# EAGLE schematic rev_a (EAGLE 6.3)
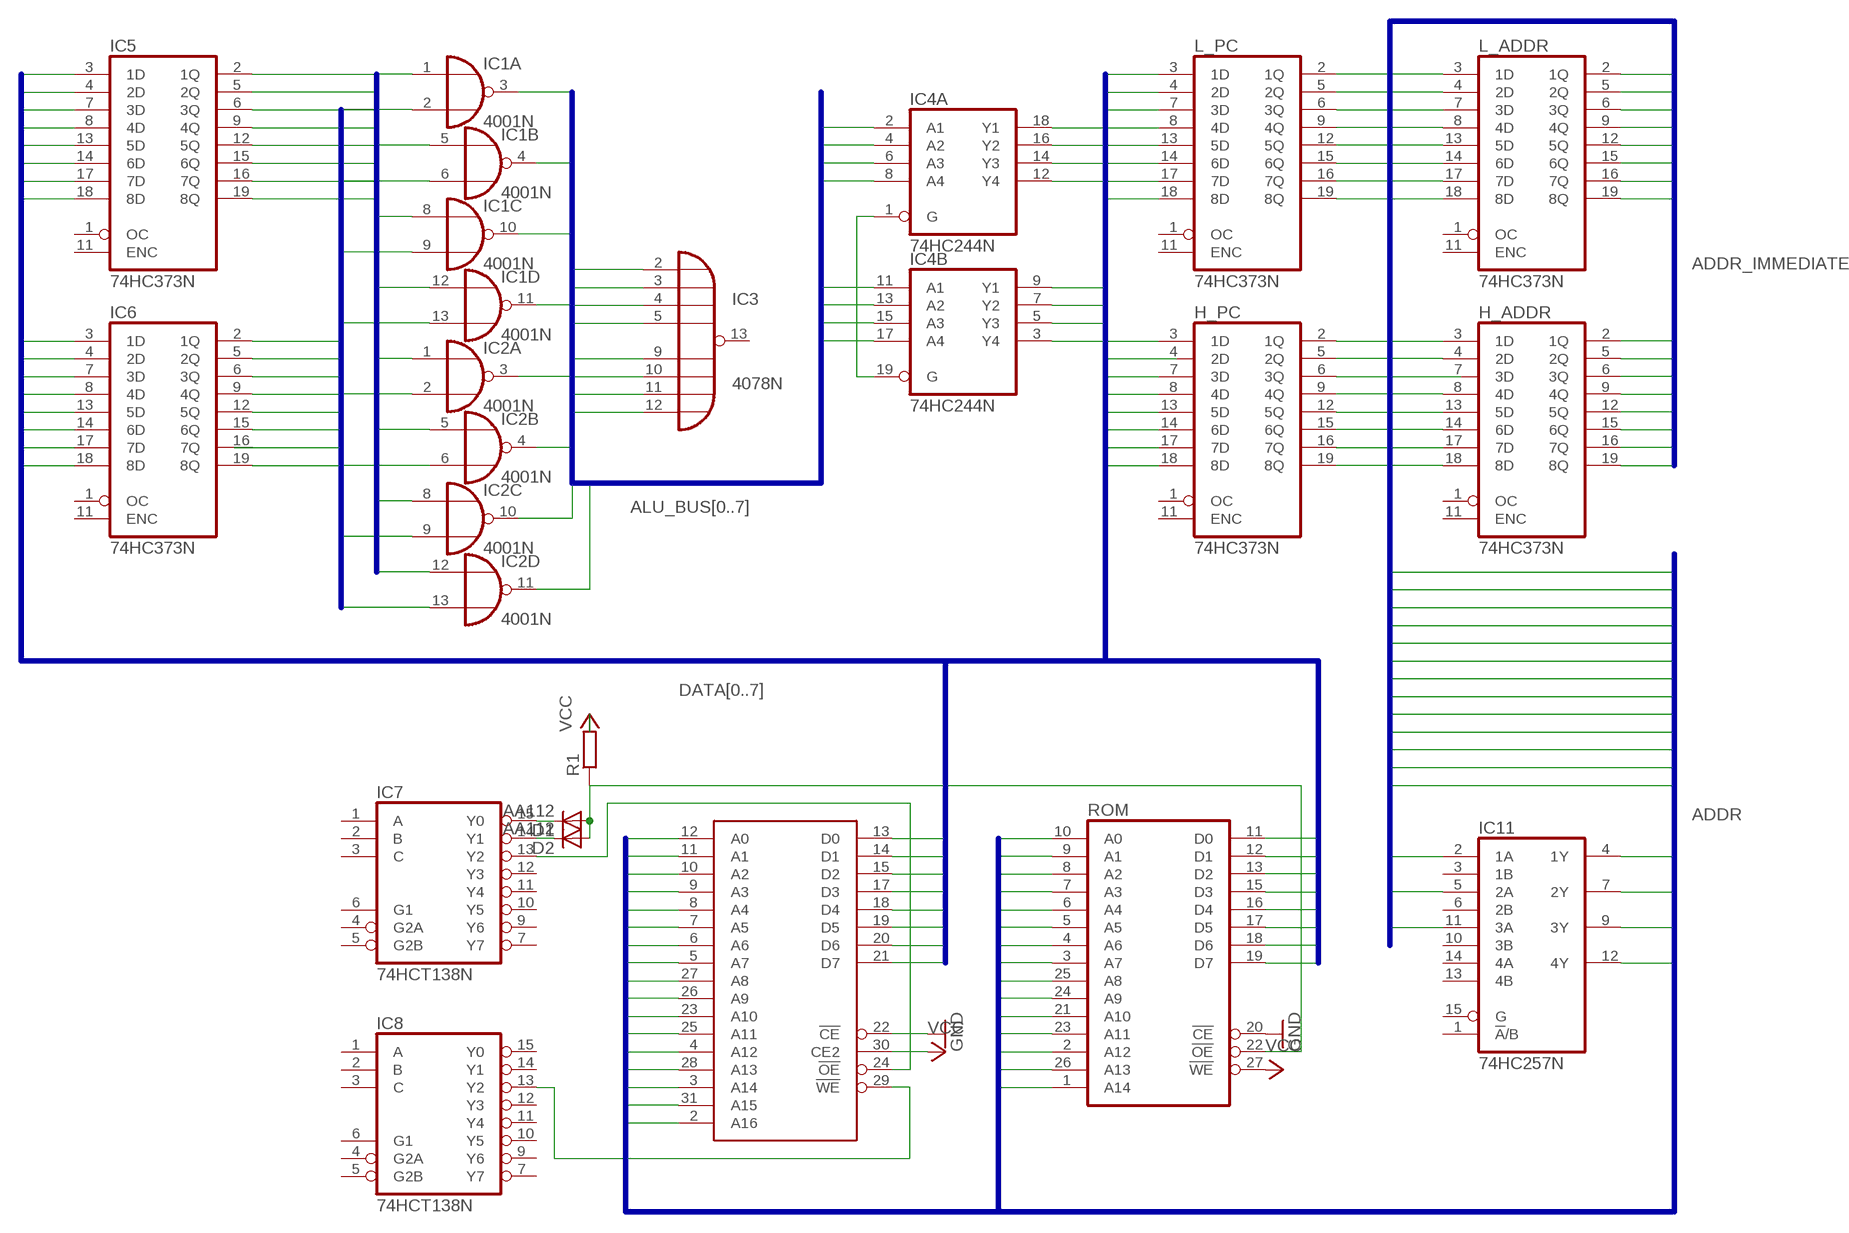
[diagram p0: schematic, sheet 1]

## Parts
D1  AA112  [DO07]
D2  AA112  [DO07]
H_ADDR  74HC373N  [DIL20]
H_PC  74HC373N  [DIL20]
IC1  4001N  [DIL14]
IC2  4001N  [DIL14]
IC3  4078N  [DIL14]
IC4  74HC244N  [DIL20]
IC5  74HC373N  [DIL20]
IC6  74HC373N  [DIL20]
IC7  74HCT138N  [DIL16]
IC8  74HCT138N  [DIL16]
IC11  74HC257N  [DIL16]
L_ADDR  74HC373N  [DIL20]
L_PC  74HC373N  [DIL20]
R1  R-EU_0207/7  [0207/7]
RAM  AS6C1008DIL32  [DIL32]
ROM  28256  [DIL28]

## Nets
A0: IC1.1(A:I0) IC5.2(1Q)
A1: IC1.5(B:I0) IC5.5(2Q)
A2: IC1.8(C:I0) IC5.6(3Q)
A3: IC1.12(D:I0) IC5.9(4Q)
A4: IC2.1(A:I0) IC5.12(5Q)
A5: IC2.5(B:I0) IC5.15(6Q)
A6: IC2.8(C:I0) IC5.16(7Q)
A7: IC2.12(D:I0) IC5.19(8Q)
ALU_BUS0: IC1.3(A:O) IC3.2(I0) IC4.2(A:A1)
ALU_BUS1: IC1.4(B:O) IC3.3(I1) IC4.4(A:A2)
ALU_BUS2: IC1.10(C:O) IC3.4(I2) IC4.6(A:A3)
ALU_BUS3: IC1.11(D:O) IC3.5(I3) IC4.8(A:A4)
ALU_BUS4: IC2.3(A:O) IC3.9(I4) IC4.11(B:A1)
ALU_BUS5: IC2.4(B:O) IC3.10(I5) IC4.13(B:A2)
ALU_BUS6: IC2.10(C:O) IC3.11(I6) IC4.15(B:A3)
ALU_BUS7: IC2.11(D:O) IC3.12(I7) IC4.17(B:A4)
B0: IC1.2(A:I1) IC6.2(1Q)
B1: IC1.6(B:I1) IC6.5(2Q)
B2: IC1.9(C:I1) IC6.6(3Q)
B3: IC1.13(D:I1) IC6.9(4Q)
B4: IC2.2(A:I1) IC6.12(5Q)
B5: IC2.6(B:I1) IC6.15(6Q)
B6: IC2.9(C:I1)
B7: IC2.13(D:I1) IC6.19(8Q)
DATA0: IC5.3(1D) IC6.3(1D)
DATA1: IC5.4(2D) IC6.4(2D)
DATA2: IC5.7(3D) IC6.7(3D)
DATA3: IC5.8(4D) IC6.8(4D)
DATA4: IC5.13(5D) IC6.13(5D)
DATA5: IC5.14(6D) IC6.14(6D)
DATA6: IC5.17(7D) IC6.17(7D)
DATA7: IC5.18(8D) IC6.18(8D)
GND: RAM.22(!CE) ROM.20(!CE)
N$1: IC4.1(A:G) IC4.19(B:G)
N$50: IC4.18(A:Y1) L_PC.8(4D)
N$51: IC4.16(A:Y2) L_PC.13(5D)
N$52: IC4.14(A:Y3) L_PC.14(6D)
N$53: IC4.12(A:Y4) L_PC.17(7D)
N$54: IC4.9(B:Y1)
N$55: IC4.7(B:Y2)
N$56: IC4.5(B:Y3)
N$57: H_PC.3(1D) IC4.3(B:Y4)
N$74: L_PC.3(1D)
N$75: L_PC.4(2D)
N$76: L_PC.7(3D)
N$77: L_PC.18(8D)
N$79: H_PC.7(3D)
N$80: H_PC.8(4D)
N$81: H_PC.13(5D)
N$82: H_PC.14(6D)
N$83: H_PC.17(7D)
N$84: H_PC.18(8D)
N$85: L_ADDR.3(1D) L_PC.2(1Q)
N$86: L_ADDR.4(2D) L_PC.5(2Q)
N$87: L_ADDR.7(3D) L_PC.6(3Q)
N$88: L_ADDR.8(4D) L_PC.9(4Q)
N$89: L_ADDR.13(5D) L_PC.12(5Q)
N$90: L_ADDR.14(6D) L_PC.15(6Q)
N$91: L_ADDR.17(7D) L_PC.16(7Q)
N$92: L_ADDR.18(8D) L_PC.19(8Q)
N$93: H_ADDR.3(1D) H_PC.2(1Q)
N$94: H_ADDR.4(2D) H_PC.5(2Q)
N$95: H_PC.6(3Q)
N$96: H_ADDR.8(4D) H_PC.9(4Q)
N$97: H_ADDR.13(5D) H_PC.12(5Q)
N$98: H_ADDR.14(6D) H_PC.15(6Q)
N$99: H_ADDR.17(7D) H_PC.16(7Q)
N$100: H_ADDR.18(8D) H_PC.19(8Q)
N$101: H_ADDR.19(8Q)
N$102: H_ADDR.16(7Q)
N$103: H_ADDR.15(6Q)
N$104: H_ADDR.12(5Q)
N$105: H_ADDR.9(4Q)
N$106: H_ADDR.6(3Q)
N$107: H_ADDR.5(2Q)
N$108: H_ADDR.2(1Q)
N$109: L_ADDR.19(8Q)
N$110: L_ADDR.16(7Q)
N$111: L_ADDR.15(6Q)
N$112: L_ADDR.12(5Q)
N$113: L_ADDR.9(4Q)
N$114: L_ADDR.6(3Q)
N$115: L_ADDR.5(2Q)
N$116: L_ADDR.2(1Q)
N$118: IC11.2(1A)
N$119: IC11.5(2A)
N$120: IC11.11(3A)
N$121: IC11.4(1Y)
N$122: IC11.7(2Y)
N$123: IC11.9(3Y)
N$124: IC11.12(4Y)
N$125: ROM.19(D7)
N$126: ROM.18(D6)
N$127: ROM.17(D5)
N$128: ROM.16(D4)
N$129: ROM.15(D3)
N$130: ROM.13(D2)
N$131: ROM.12(D1)
N$132: ROM.11(D0)
N$133: RAM.13(D0)
N$134: RAM.14(D1)
N$135: RAM.15(D2)
N$136: RAM.17(D3)
N$137: RAM.18(D4)
N$138: RAM.19(D5)
N$139: RAM.20(D6)
N$140: RAM.21(D7)
N$141: RAM.12(A0)
N$142: RAM.11(A1)
N$143: RAM.10(A2)
N$144: RAM.9(A3)
N$145: RAM.8(A4)
N$146: RAM.7(A5)
N$147: RAM.6(A6)
N$148: RAM.5(A7)
N$149: RAM.27(A8)
N$150: RAM.26(A9)
N$151: RAM.23(A10)
N$152: RAM.25(A11)
N$153: RAM.4(A12)
N$154: RAM.28(A13)
N$155: RAM.3(A14)
N$156: RAM.31(A15)
N$157: RAM.2(A16)
N$158: D1.C IC7.15(Y0)
N$159: ROM.9(A1)
N$160: ROM.8(A2)
N$161: ROM.7(A3)
N$162: ROM.6(A4)
N$163: ROM.5(A5)
N$164: ROM.4(A6)
N$165: ROM.3(A7)
N$166: ROM.25(A8)
N$167: ROM.24(A9)
N$168: ROM.21(A10)
N$169: ROM.23(A11)
N$170: ROM.2(A12)
N$171: ROM.26(A13)
N$172: ROM.1(A14)
N$173: D1.A D2.A R1.1 ROM.22(!OE)
N$174: D2.C IC7.14(Y1)
N$175: IC7.13(Y2) RAM.24(!OE)
N$176: IC8.13(Y2) RAM.29(!WE)
ROM: ROM.10(A0)
VCC: R1.2 RAM.30(CE2) ROM.27(!WE)
Unconnected: H_ADDR.1(OC) H_ADDR.7(3D) H_ADDR.11(ENC) H_PC.1(OC) H_PC.4(2D) H_PC.11(ENC) IC3.13(J) IC5.1(OC) IC5.11(ENC) IC6.1(OC) IC6.11(ENC) IC6.16(7Q) IC7.1(A) IC7.2(B) IC7.3(C) IC7.4(G2A) IC7.5(G2B) IC7.6(G1) IC7.7(Y7) IC7.9(Y6) IC7.10(Y5) IC7.11(Y4) IC7.12(Y3) IC8.1(A) IC8.2(B) IC8.3(C) IC8.4(G2A) IC8.5(G2B) IC8.6(G1) IC8.7(Y7) IC8.9(Y6) IC8.10(Y5) IC8.11(Y4) IC8.12(Y3) IC8.14(Y1) IC8.15(Y0) IC11.1(!A!/B) IC11.3(1B) IC11.6(2B) IC11.10(3B) IC11.13(4B) IC11.14(4A) IC11.15(G) L_ADDR.1(OC) L_ADDR.11(ENC) L_PC.1(OC) L_PC.11(ENC)

## Buses
ALU_BUS[0..7]
A[0..7]
B[0..7]
DATA[0..7]
ADDR_IMMEDIATE
ADDR

## Power pins joined to a net without a drawn wire
GND: H_ADDR.10(GND) H_PC.10(GND) IC4.10(P:GND) IC5.10(GND) IC6.10(GND) IC7.8(GND) IC8.8(GND) IC11.8(GND) L_ADDR.10(GND) L_PC.10(GND)
VCC: H_ADDR.20(VCC) H_PC.20(VCC) IC4.20(P:VCC) IC5.20(VCC) IC6.20(VCC) IC7.16(VCC) IC8.16(VCC) IC11.16(VCC) L_ADDR.20(VCC) L_PC.20(VCC)
VDD: IC1.14(P:VDD) IC2.14(P:VDD) IC3.14(VDD)
VSS: IC1.7(P:VSS) IC2.7(P:VSS) IC3.7(VSS)

## Library data of the parts
D1 D2 = diode:AA112: DIODE germanium
H_ADDR H_PC IC5 IC6 L_ADDR L_PC = 74xx-eu:74*373: Octal D type transparent LATCH, edge triggered
IC1 IC2 = 40xx:4001: Quad 2-input NOR
IC3 = 40xx:4078: 8-input NOR
IC4 = 74xx-eu:74*244: Octal BUFFER and LINE DRIVER, 3-state
IC7 IC8 = 74xx-eu:74*138: 3-line to 8-line DECODER/DEMULTIPLEXER
IC11 = 74xx-eu:74*257: Quadruple 2-to 1 line data SELECTOR/MULTIPLEXER
R1 = resistor:R-EU_: RESISTOR, European symbol
RAM = forkmachine:AS6C1008: 8 x 128Kbit CMOS SRAM
ROM = forkmachine:28256: AT28HC256 Parallel 8 x 32Kbit EEPROM